# Altium schematic sheet Port.SchDoc
size 177 x 165 mm; SheetNumber: 5; SheetTotal: 6; SPICEModelCacheZMLSMFEG: <root> / <DocumentId>ZMLSMFEG</DocumentId> / </root>
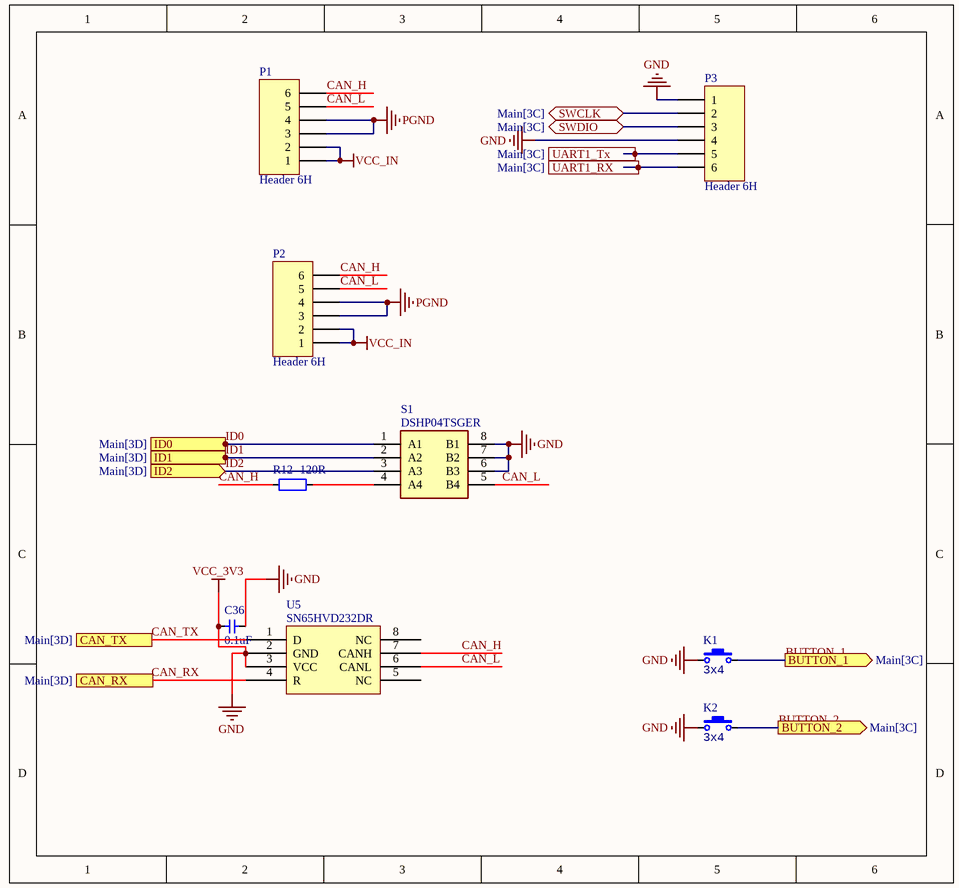
[diagram p0: Port.SchDoc]

## Parts
C36  0.1uF  [CAP_0402]
K1  value 3x4  [ButtonTACT_3x4x2_180]  (hidden comment: TACT 2P)
K2  value 3x4  [ButtonTACT_3x4x2_180]  (hidden comment: TACT 2P)
P1  Header 6H  [CONN-TH_HC-ZH1.5-6A-s]
P2  Header 6H  [CONN-TH_HC-ZH1.5-6A-s]
P3  Header 6H  [CONN-TH_HC-ZH1.5-6A-s]
R12  120R  [RES_0402]
S1  DSHP04TSGER  [SW-SMD_DSHP04TS-S]
U5  Manufacturer Part Number: SN65HVD232DR  [so-8]  (hidden comment: SN65HVD232D)

## Ports
BUTTON_1 (out, see Main[3C]), BUTTON_2 (out, see Main[3C]), CAN_RX (see Main[3D]), CAN_TX (see Main[3D]), ID0 (in, see Main[3D]), ID1 (in, see Main[3D]), ID2 (in, see Main[3D]), SWCLK (bidir, see Main[3C]), SWDIO (bidir, see Main[3C]), UART1_RX (out, see Main[3C]), UART1_Tx (out, see Main[3C])

## Nets
GND: C36.1 C36.2 K1.1 K2.1 P3.1 P3.4 S1.6(B3) S1.7(B2) S1.8(B1) U5.2(GND) U5.3(VCC)  [also labelled VCC_3V3]
PGND: P1.3 P1.4 P2.3 P2.4
VCC_IN: P1.1 P1.2 P2.1 P2.2
BUTTON_1: K1.2 ; port BUTTON_1
BUTTON_2: K2.2 ; port BUTTON_2
CAN_H: P1.6 P2.6 R12.1 U5.7(CANH)
CAN_L: P1.5 P2.5 S1.5(B4) U5.6(CANL)
CAN_RX: U5.4(R) ; port CAN_RX
CAN_TX: U5.1(D) ; port CAN_TX
ID0: S1.1(A1) ; port ID0
ID1: S1.2(A2) ; port ID1
ID2: S1.3(A3) ; port ID2
SWCLK: P3.2 ; port SWCLK
SWDIO: P3.3 ; port SWDIO
UART1_RX: P3.6 ; port UART1_RX
UART1_Tx: P3.5 ; port UART1_Tx
NetR12_2: R12.2 S1.4(A4)

Not connected (* = marked no-connect by the designer): U5 5(NC) 8(NC)

## Library data of the parts
C36 = 电容-0402: Capacitor; Value: 0.1u
K1 K2 = ButtonTACT_3x4x2_180: Button; type: TACT 2P
P1-P3 = Header 6H: Header, 6-Pin, Right Angle; LatestRevisionDate: 17-Jul-2002; LatestRevisionNote: Re-released for DXP Platform.; Publisher: Altium Limited
R12 = 电阻-0402: Resistor; Value: 22R
S1 = 218-4LPSTJ: DIP Switches / SIP Switches 4 pos. low profile Btm Seal Tape J Bend; Manufacturer_Name: CTS; Geometry.Height: 2.7mm; Mouser Part Number: 774-218-4LPSTJ; Mouser Price/Stock: https://www.mouser.co.uk/ProductDetail/CTS-Electronic-Components/218-4LPSTJ?qs=qNzHFtQhdJ%2Frpuf7cnHHWA%3D%3D; Manufacturer_Part_Number: 218-4LPSTJ; Datasheet Link: https://www.ctscorp.com/wp-content/uploads/218.pdf
U5 = SN65HVD232D: Manufacturer: Texas Instruments; Protocol: CAN; Number of Drivers/Receivers: 1/1; Duplex: Half; Data Rate: 1Mbps; Voltage - Supply: 3 V ~ 3.6 V; Supplier 1: Digi-Key; Supplier Part Number 1: 296-26344-2-ND; RoHS: RoHS Compliant; Category: Integrated Circuits (ICs); Stock: 5000; Pricing 1: 2500=0.84375 (USD); Packaging: Tape & Reel (TR); Part Status: Active; Type: Transceiver; Operating Temperature: -40°C ~ 85°C; Mounting Type: Surface Mount; Package / Case: 8-SOIC (0.154", 3.90mm Width); Supplier Device Package: 8-SOIC; ComponentLink1URL: http://www.ti.com/lit/ds/symlink/sn65hvd230.pdf; ComponentLink1Description: http://www.ti.com/lit/ds/symlink/sn65hvd230.pdf; Supplier 2: Digi-Key; Supplier Part Number 2: 296-26344-1-ND; Pricing 2: 1=2.05, 10=1.842, 100=1.4809, 500=1.21668, 1000=1.00811 (USD)